# EasyEDA Pro project ProProject_gps打窝船_2025-04-29.epro, board PCB3
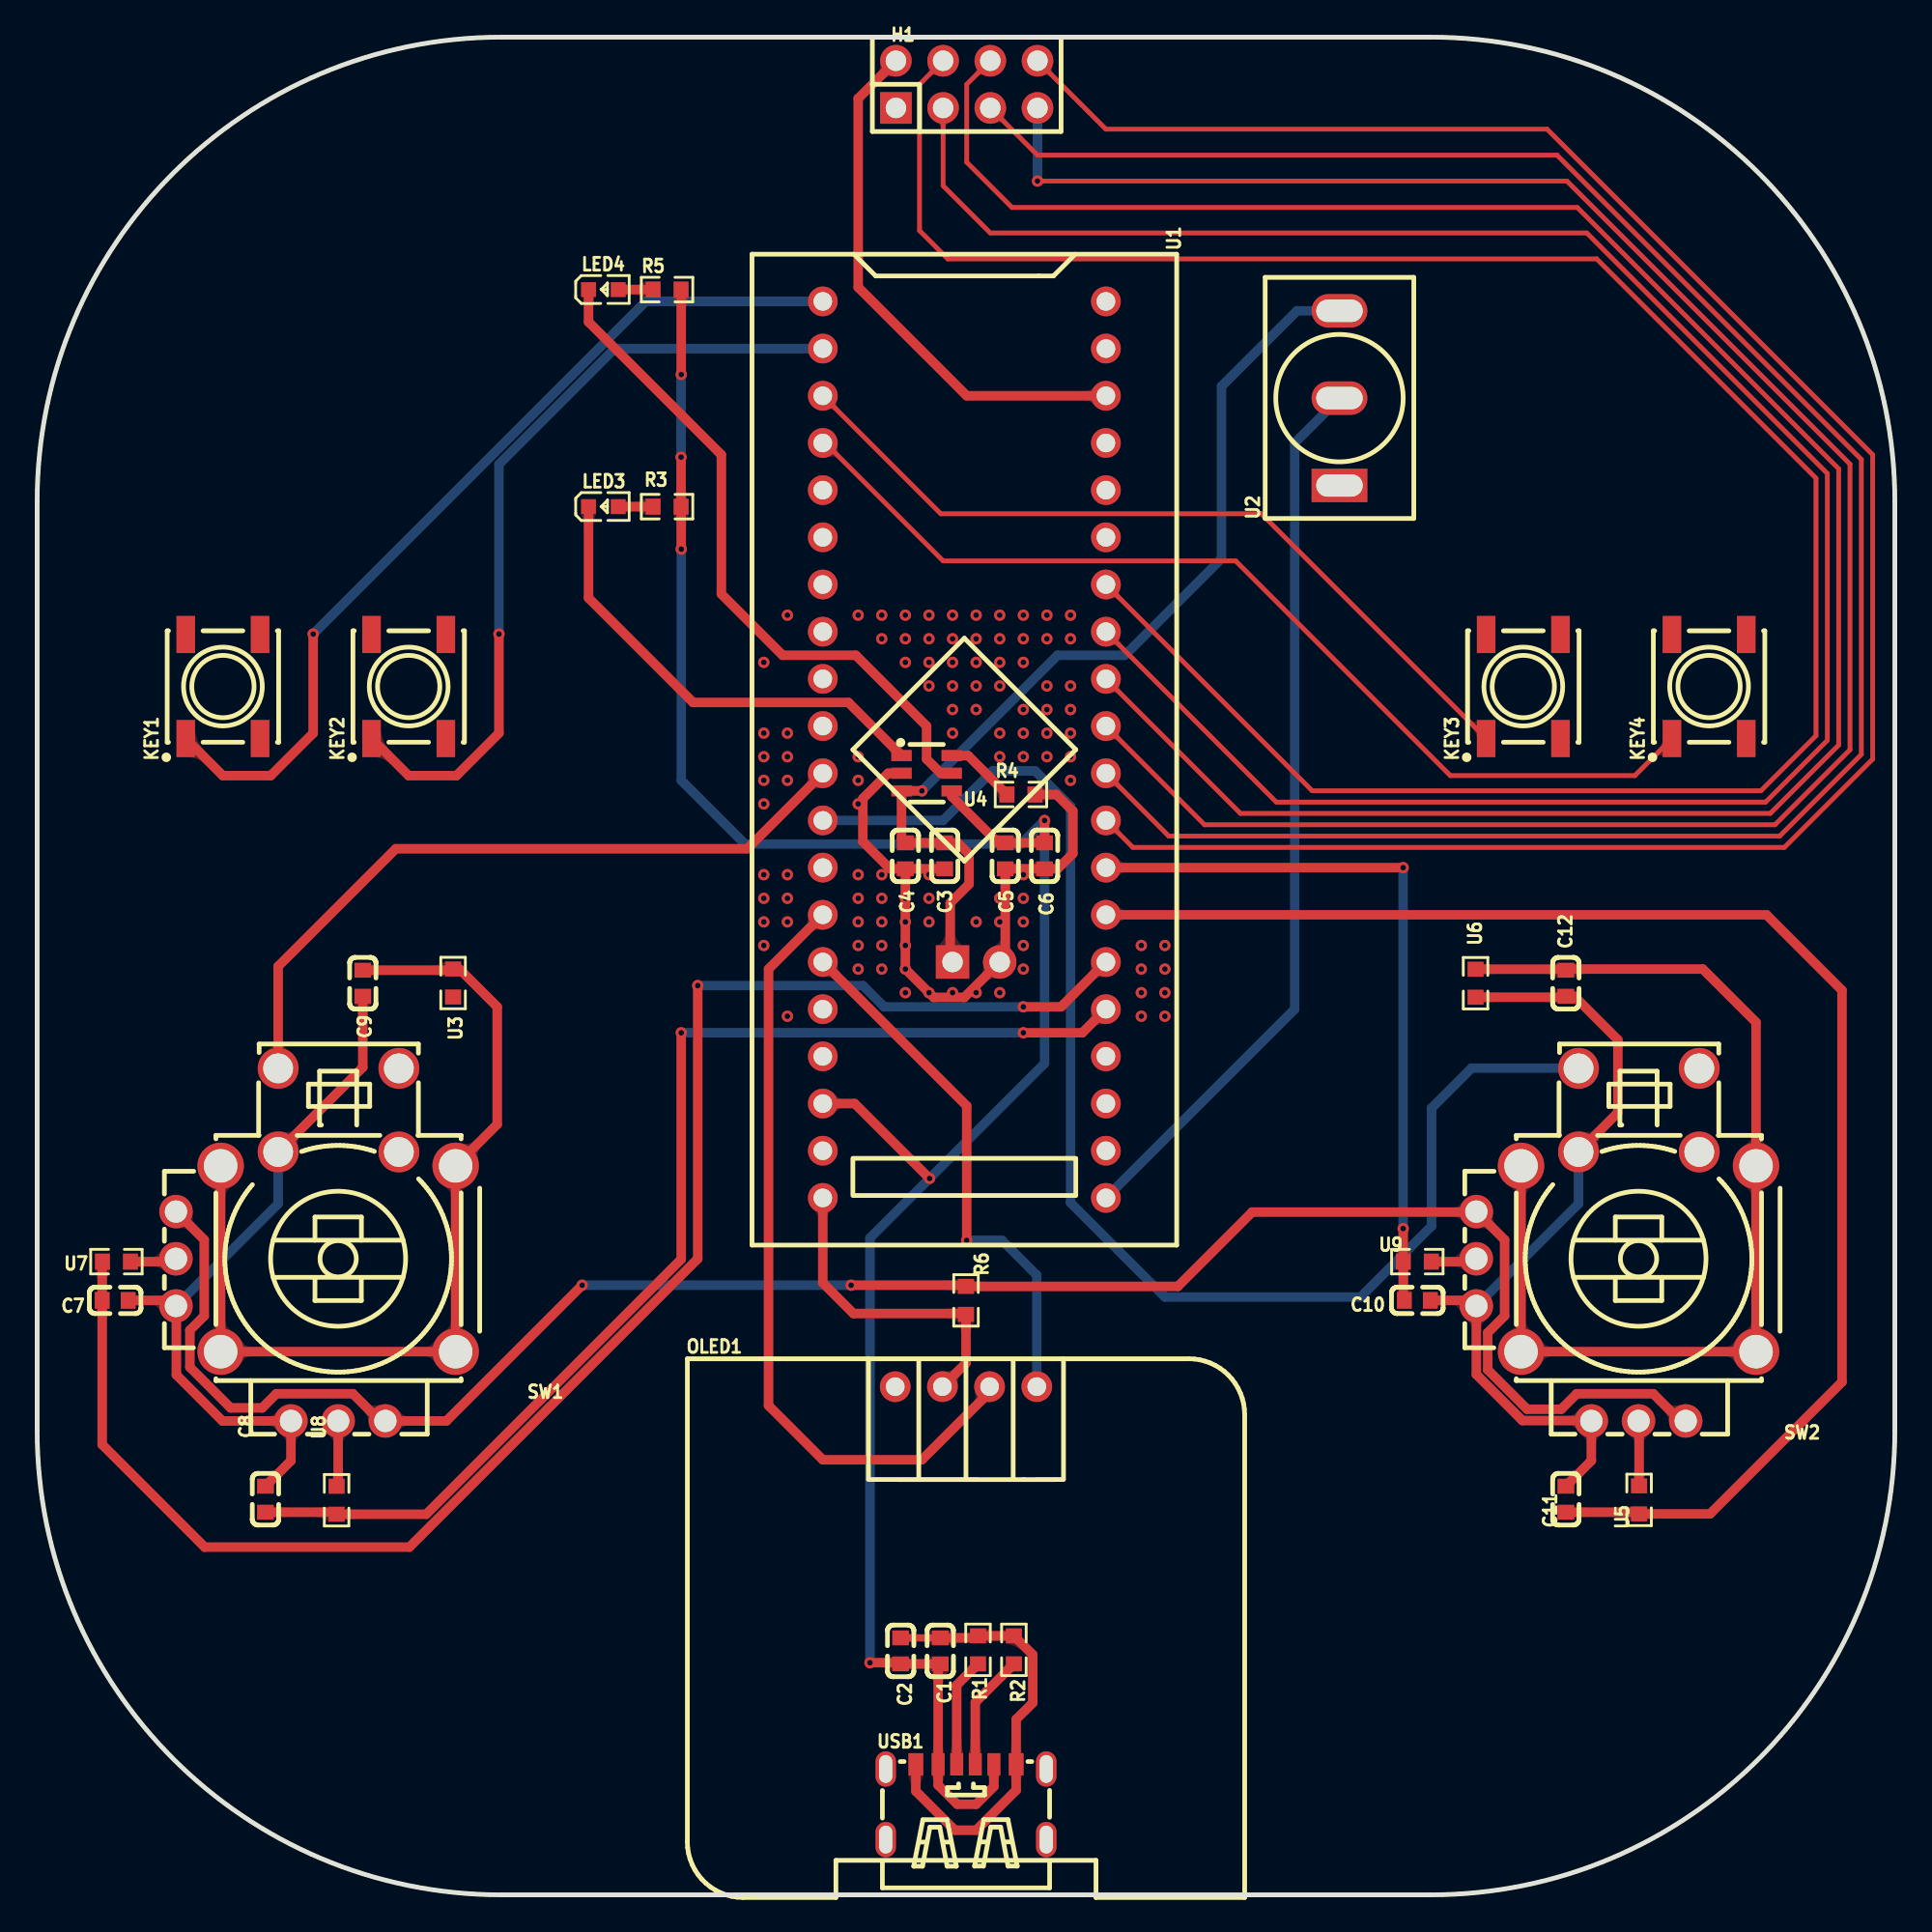
[diagram p2: board, top side]
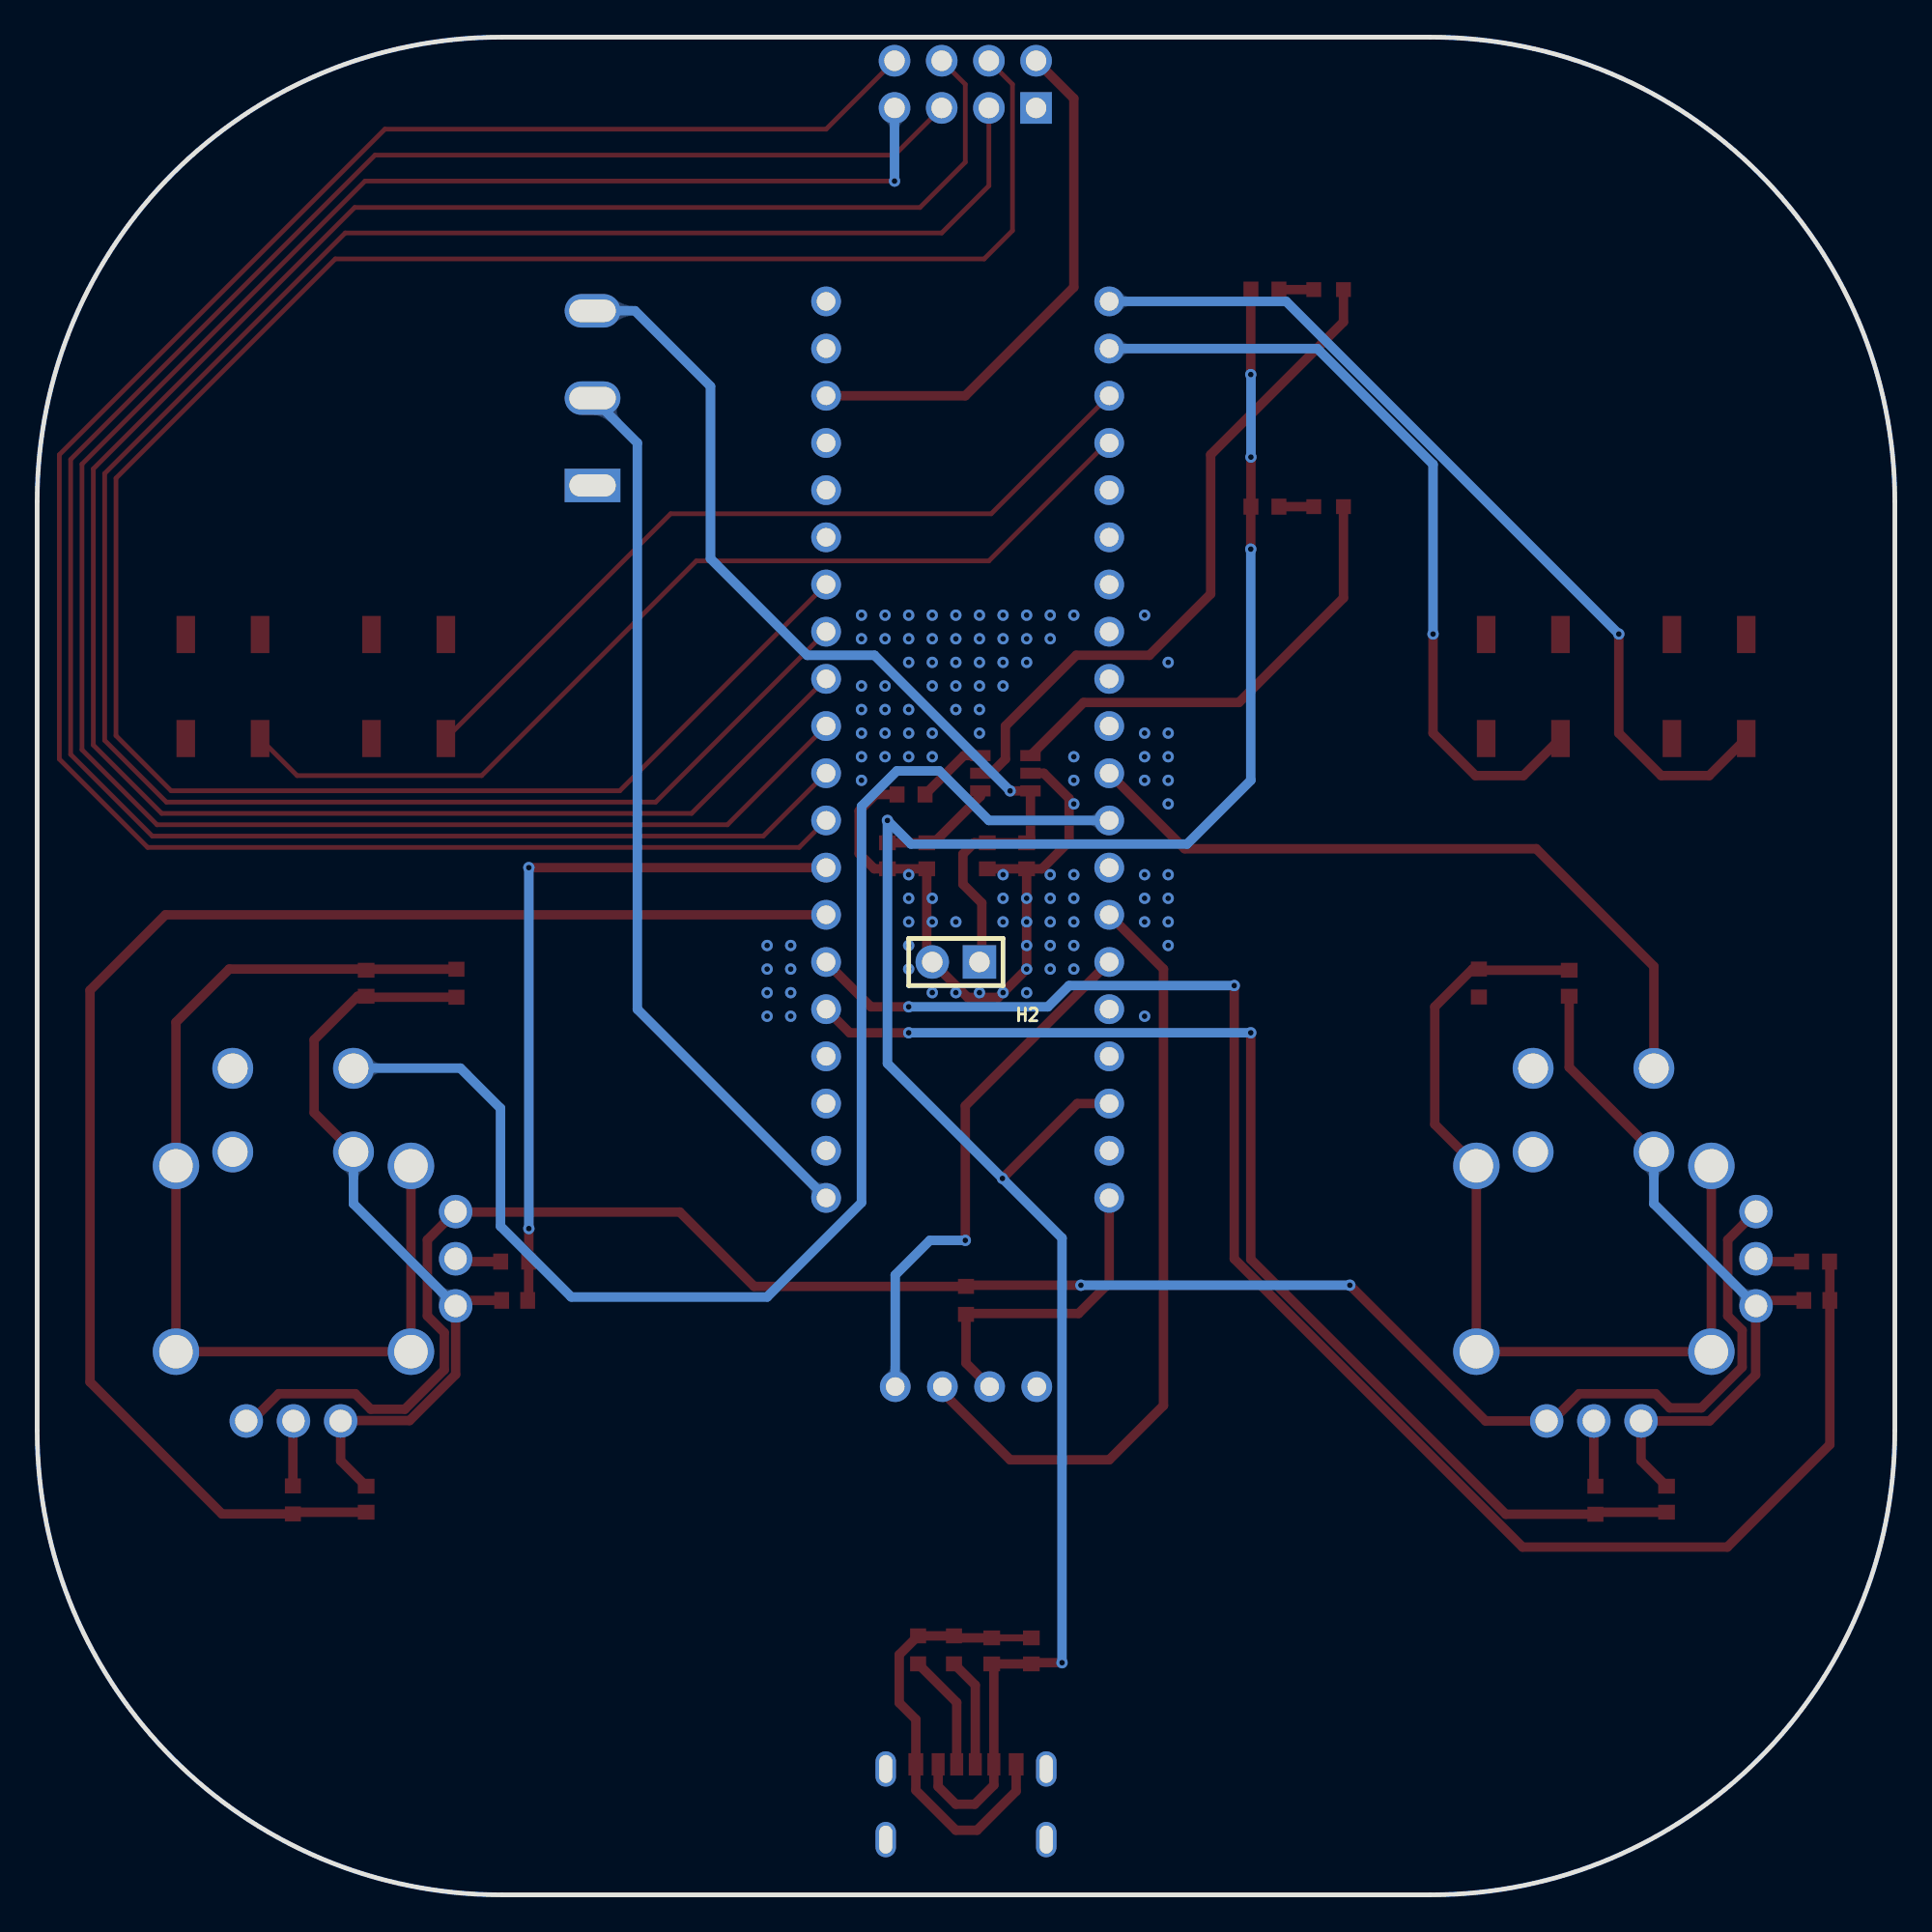
[diagram p3: board, bottom side, seen from below]

Outline 100 x 100 mm; copper layers: Top Layer, Bottom Layer. Coordinates in mm from the lower left corner of the outline.
Outline path: 0,75 arc(7.32,92.68) 25,100 75,100 arc(92.68,92.68) 100,75 100,25 arc(92.68,7.32) 75,0 25,0 arc(7.32,7.32) 0,25 0,75
Stack: Top Layer 0.035mm / Dielectric1 1.51mm FR4 er 4.5 / Bottom Layer 0.035mm

## Design rules (mm)
template: 自定义配置
spacing copperThickness1oz (default): track to track 0.102, other pairs 0.152 to 0.3
spacing copperThickness2oz: track to track 0.203, other pairs 0.152 to 0.3
track width copperThickness1oz (default): min 0.127, default 0.254, max 2.54
track width copperThickness2oz: min 0.203, default 0.254, max 2.54
differential pair differentialPair (default): width min 0.127, default 0.254, max 2.54; gap min 0.152, default 0.152
via viaSize (default): diameter min 0.5, default 0.61, max 10; hole min 0.3, default 0.305, max 6.3

## Placement (name value [footprint] x y rotation side)
C1  22uF  [C0603]  48.61 13.13 270 top
C2  100nf  [C0603]  46.48 13.13 270 top
C3  1uF  [C0603]  48.85 55.93 90 top
C4  10uF  [C0603]  46.74 55.93 90 top
C5  1uF  [C0603]  52.11 55.93 90 top
C6  10uF  [C0603]  54.23 55.93 90 top
C7  1nF  [C0603]  4.2 32 0 top
C8  1nF  [C0603]  12.29 21.3 270 top
C9  100nF  [C0603]  17.53 49.07 90 top
C10  1nF  [C0603]  74.29 32 0 top
C11  1nF  [C0603]  82.29 21.3 270 top
C12  100nF  [C0603]  82.29 49.07 90 top
H1  PZ254V-12-8P  [HDR-TH_8P-P2.54-V-M-R2-C4-S2.54]  50.04 97.46 0 top
H2  PH2.54-01-02PZD  [HDR-TH_2P-P2.54-V-M-1]  50.55 50.22 0 bottom
KEY1  KEY_6.5X6.5X5-4P  [KEY-SMD_4P-L6.0-W6.0-P4.00-LS6.7]  10 65.04 90 top
KEY2  KEY_6.5X6.5X5-4P  [KEY-SMD_4P-L6.0-W6.0-P4.00-LS6.7]  20 65.04 90 top
KEY3  KEY_6.5X6.5X5-4P  [KEY-SMD_4P-L6.0-W6.0-P4.00-LS6.7]  80 65.04 90 top
KEY4  KEY_6.5X6.5X5-4P  [KEY-SMD_4P-L6.0-W6.0-P4.00-LS6.7]  90 65.04 90 top
LED3  LTST-C190YKT  [LED0603-RD]  30.48 74.73 0 top
LED4  LTST-C190YKT  [LED0603-RD]  30.48 86.41 0 top
OLED1  -  [0.96OLED_4P]  50 27.36 0 top
R1  5.1kΩ  [R0603]  50.65 13.19 90 top
R2  5.1kΩ  [R0603]  52.58 13.19 90 top
R3  1kΩ  [R0603]  33.91 74.73 180 top
R4  2kΩ  [R0603]  52.96 59.23 0 top
R5  1kΩ  [R0603]  33.91 86.41 0 top
R6  0Ω  [R0603]  50 32 270 top
SW1  THB001P  [SW-TH_THB001P]  15 35 180 top
SW2  THB001P  [SW-TH_THB001P]  85 35 180 top
U1  STM32F103C8T6-Card  [CONN-TH_L53.3-W22.9_STM32F103C8T6-CARD]  49.91 61.65 270 top
U2  MT-0-102-A101-M200-RS  [SW-TH_MT-0-103-A101-M200-RS]  70.1 80.57 90 top
U3  1M  [R0603]  22.39 49.08 90 top
U4  TP4057  [SOT-23-6_L2.9-W1.6-P0.95-LS2.8-BR]  47.88 60.38 180 top
U5  1K  [R0603]  86.23 21.26 270 top
U6  1M  [R0603]  77.43 49.07 90 top
U7  1K  [R0603]  4.27 34.09 180 top
U8  1K  [R0603]  16.12 21.24 270 top
U9  1K  [R0603]  74.29 34.09 180 top
USB1  TYPE-C 6P  [TYPE-C-SMD_TYPE-C-6P]  50 5 0 top

## Footprints (pads in the part's own frame, mm; a bottom-side part is the same pattern mirrored in y, then rotated)
0.96OLED_4P
  round 1.65 hole 1: 1(-3.81,-0.002) 2(-1.27,0.002) 3(1.27,0.002) 4(3.81,0.002)
C0603
  rect 0.8x0.9 smd: 1(-0.7,0) 2(0.7,0)
CONN-TH_L53.3-W22.9_STM32F103C8T6-CARD
  round 1.6 hole 1: 1(-24.13,-7.62) 2(-21.59,-7.62) 3(-19.05,-7.62) 4(-16.51,-7.62) 5(-13.97,-7.62) 6(-11.43,-7.62) 7(-8.89,-7.62) 8(-6.35,-7.62) 9(-3.81,-7.62) 10(-1.27,-7.62) 11(1.27,-7.62) 12(3.81,-7.62) 13(6.35,-7.62) 14(8.89,-7.62) 15(11.43,-7.62) 16(13.97,-7.62) 17(16.51,-7.62) 18(19.05,-7.62) 19(21.59,-7.62) 20(24.13,-7.62) 21(24.13,7.62) 22(21.59,7.62) 23(19.05,7.62) 24(16.51,7.62) 25(13.97,7.62) 26(11.43,7.62) 27(8.89,7.62) 28(6.35,7.62) 29(3.81,7.62) 30(1.27,7.62) 31(-1.27,7.62) 32(-3.81,7.62) 33(-6.35,7.62) 34(-8.89,7.62) 35(-11.43,7.62) 36(-13.97,7.62) 37(-16.51,7.62) 38(-19.05,7.62) 39(-21.59,7.62) 40(-24.13,7.62)
HDR-TH_2P-P2.54-V-M-1
  rect 1.8x1.8 hole 1.1: 1(-1.27,0)
  round 1.8 hole 1.1: 2(1.27,0)
HDR-TH_8P-P2.54-V-M-R2-C4-S2.54
  rect 1.7x1.7 hole 1.1: 1(-3.81,-1.27)
  round 1.7 hole 1.1: 2(-3.81,1.27) 3(-1.27,-1.27) 4(-1.27,1.27) 5(1.27,-1.27) 6(1.27,1.27) 7(3.81,-1.27) 8(3.81,1.27)
KEY-SMD_4P-L6.0-W6.0-P4.00-LS6.7
  rect 2x1 smd: 1(-2.8,2) 2(2.8,2) 3(-2.8,-2) 4(2.8,-2)
LED0603-RD
  rect 0.8x0.8 smd: 1(-0.799,0) 2(0.799,0)
R0603
  rect 0.806x0.864 smd: 1(-0.753,0) 2(0.753,0)
SOT-23-6_L2.9-W1.6-P0.95-LS2.8-BR
  rect 1.1x0.6 smd: 1(1.35,-0.95) 2(1.35,0) 3(1.35,0.95) 4(-1.35,0.95) 5(-1.35,0) 6(-1.35,-0.95)
SW-TH_MT-0-103-A101-M200-RS
  rect 1.8x3 hole 1.2x2.5: 1(-4.7,0)
  oval 1.8x3 hole 1.2x2.5: 2(0,0) 3(4.7,0)
SW-TH_THB001P
  round 1.8 hole 1.2: 1(7.527,-1.78) 2(7.527,0.76) 3(7.527,3.3) 4(1.337,9.49) 5(-1.202,9.49) 6(-3.743,9.49)
  round 2.5 hole 1.8: 7(-7.527,5.76) 8(-7.527,-4.24) 9(5.122,-4.24) 10(5.122,5.76)
  round 2.2 hole 1.6: a(-4.472,-4.99) b(2.028,-4.99) c(-4.472,-9.49) d(2.028,-9.49)
TYPE-C-SMD_TYPE-C-6P
  oval 1.1x1.9 hole 0.7x1.5: 7(-4.32,1.775) 7(-4.32,-2.025) 7(4.32,1.775) 7(4.32,-2.025)
  rect 0.7x1.2 smd: A5(-0.5,2.025) A9(1.5,2.025) B5(0.5,2.025) B9(-1.5,2.025)
  rect 0.8x1.2 smd: A12(2.7,2.025) B12(-2.7,2.025)

## Nets
As in the schematic, except:
GND: C1.1 C2.1 C3.1 C4.1 C5.1 C6.1 C7.2 C8.1 C9.1 C10.2 C11.1 C12.1 H1.1 H2.2 KEY1.4 KEY2.4 KEY3.4 KEY4.4 OLED1.1 R1.2 R2.2 R4.2 SW1.3 SW1.4 SW1.b SW2.3 SW2.4 SW2.b U1.19 U1.39 U1.40 U3.1 U4.2 U6.1 USB1.A12 USB1.B12
VCC3V3: H1.2 OLED1.2 R6.2 U1.20 U1.38
$1N2627: OLED1.4 U1.15
$1N2638: OLED1.3 U1.14

Pads without a net: KEY1 2 3; KEY2 2 3; KEY3 2 3; KEY4 2 3; SW1 a c; SW2 a c; U1 5 6 7 8 9 10 13 16 17 22 23 24 35 36 37; U2 1; USB1 7

## Via types
v1: diameter 0.61, hole 0.305, Top Layer to Bottom Layer, 123 vias

## Routing (per net, layer and track width the routed paths; a pad name or vN(x,y) marks a point on that pad's centre or on a via; arc(x,y) is an arc through that point)
+5V: length 127.5
  Top Layer w0.508: v1(54.23,57.84) C6.2 51.73,56.63 49.23,59.13 U4.4 ; v1(34.66,77.39) R3.1 34.67,74.72 v1(34.67,72.44) ; v1(48.04,38.56) 44.01,42.6 U1.18 ; v1(44.83,12.5) 46.42,12.5 C2.2 C1.2 48.5,12.32 USB1.B9 48.5,5.91 49.53,4.88 50.55,4.88 51.5,5.83 USB1.A9 ; v1(34.67,81.84) 34.67,86.4 R5.2
  Bottom Layer w0.508: v1(34.67,81.84) 34.66,81.83 v1(34.66,77.39) ; v1(44.83,12.5) 44.83,35.36 v1(48.04,38.56) 54.23,44.75 v1(54.23,57.84) 52.96,56.57 38.1,56.57 34.67,60 v1(34.67,72.44)
GND: length 141.8
  Top Layer w0.381: C2.1 C1.1
  Top Layer w0.508: U6.1 82.24,48.32 C12.1 82.74,48.37 85.09,46.03 85.09,42.11 SW2.b ; SW1.b 17.53,44.55 C9.1 ; R4.2 54.86,59.23 55.75,58.34 55.75,56.05 54.93,55.23 C6.1 C5.1 52.11,50.51 H2.2 49.91,48.31 48.26,48.31 v1(48.01,48.56) v1(46.74,49.83) v1(46.74,51.11) v1(46.74,52.38) v1(46.74,53.64) C4.1 ; C4.1 45.91,55.23 44.45,56.69 44.45,59.02 45.81,60.38 U4.2 ; C4.1 C3.1 ; 75,32 77.17,32 SW2.3 77.47,28.01 79.95,25.53 83.64,25.53 ; USB1.B12 47.3,5.58 49.4,3.48 50.55,3.48 52.7,5.63 USB1.A12 52.7,9.44 53.59,10.34 53.59,12.93 R2.2 R1.2 50.54,13.83 C1.1 ; C7.2 7.17,32 SW1.3 7.49,31.68 7.49,27.99 9.97,25.51 SW1.4 13.66,23.37 C8.1 ; C11.1 83.66,23.37 SW2.4
  Bottom Layer w0.508: SW1.3 12.97,37.2 SW1.b ; SW2.b 82.97,37.2 SW2.3
  vias: v1(39.12,66.34) v1(39.12,62.53) v1(39.12,61.27) v1(39.12,60) v1(39.12,58.72) v1(39.12,54.92) v1(39.12,53.64) v1(39.12,52.38) v1(39.12,51.11) v1(40.39,68.89) v1(40.39,62.53) v1(40.39,61.27) v1(40.39,60) v1(40.39,54.92) v1(40.39,53.64) v1(40.39,52.38) v1(40.39,47.3) v1(44.2,68.89) v1(44.2,61.27) v1(44.2,60) v1(44.2,58.72) v1(44.2,54.92) v1(44.2,53.64) v1(44.2,52.38) v1(44.2,51.11) v1(44.2,49.83) v1(45.47,68.89) v1(45.47,67.61) v1(45.47,54.92) v1(45.47,53.64) v1(45.47,52.38) v1(45.47,51.11) v1(45.47,49.83) v1(46.74,68.89) v1(46.74,67.61) v1(46.74,66.34) v1(46.74,48.56) v1(48.01,68.89) v1(48.01,67.61) v1(48.01,66.34) v1(48.01,65.08) v1(48.01,54.92) v1(48.01,53.64) v1(48.01,52.38) v1(49.28,68.89) v1(49.28,67.61) v1(49.28,66.34) v1(49.28,65.08) v1(49.28,63.81) v1(49.28,62.53) v1(49.28,48.56) v1(50.55,68.89) v1(50.55,67.61) v1(50.55,66.34) v1(50.55,65.08) v1(50.55,63.81) v1(50.55,52.38) v1(50.55,48.56) v1(51.82,68.89) v1(51.82,67.61) v1(51.82,66.34) v1(51.82,65.08) v1(51.82,62.53) v1(51.82,61.27) v1(51.82,53.64) v1(51.82,52.38) v1(51.82,48.56) v1(53.09,68.89) v1(53.09,67.61) v1(53.09,66.34) v1(53.09,63.81) v1(53.09,62.53) v1(53.09,61.27) v1(53.09,54.92) v1(53.09,53.64) v1(53.09,52.38) v1(53.09,51.11) v1(53.09,49.83) v1(54.36,68.89) v1(54.36,67.61) v1(54.36,65.08) v1(54.36,63.81) v1(54.36,62.53) v1(54.36,61.27) v1(55.63,68.89) v1(55.63,67.61) v1(55.63,65.08) v1(55.63,63.81) v1(55.63,62.53) v1(55.63,61.27) v1(55.63,60) v1(59.44,51.11) v1(59.44,49.83) v1(59.44,48.56) v1(59.44,47.3) v1(60.71,51.11) v1(60.71,49.83) v1(60.71,48.56) v1(60.71,47.3)
VCC3V3: length 46.2
  Top Layer w0.508: OLED1.2 50,28.63 R6.2 49.95,31.29 43.94,31.29 42.29,32.94 U1.20 ; U1.38 50.04,80.7 44.2,86.54 44.2,96.7 H1.2
32BAT: length 48.3
  Bottom Layer w0.508: U1.21 67.69,47.68 67.69,78.16 U2.2
BAT: length 52.5
  Top Layer w0.508: 49.15,50.22 49.15,53.39 50.16,54.41 50.16,56.02 49.56,56.63 C3.2 C4.2 46.53,56.84 U4.3 v1(47.62,59.43)
  Bottom Layer w0.508: U2.3 67.82,85.27 63.75,81.2 63.75,71.93 58.55,66.73 54.93,66.73 v1(47.62,59.43)
PA0: length 63.7
  Top Layer w0.508: v1(53.09,46.41) 56.26,46.41 U1.25 ; C8.2 16.01,20.6 U8.2 20.95,20.49 34.67,34.21 v1(34.67,46.41)
  Bottom Layer w0.508: v1(34.67,46.41) v1(53.09,46.41)
PA1: length 88.8
  Top Layer w0.508: v1(53.09,47.8) 55.12,47.8 U1.26 ; U7.2 3.5,34.07 C7.1 3.5,24.24 9.02,18.72 20.04,18.72 35.56,34.24 v1(35.56,48.95)
  Bottom Layer w0.508: v1(53.09,47.8) 45.59,47.8 44.45,48.95 v1(35.56,48.95)
PA2: length 80.2
  Top Layer w0.508: U1.27 93.09,52.76 97.16,48.69 97.16,27.61 90.05,20.51 U5.2 86.14,20.6 C11.2
PA3: length 39.3
  Top Layer w0.508: C10.1 73.54,32.05 U9.2 73.53,34.1 v1(73.53,35.86) ; U1.28 v1(73.53,55.3)
  Bottom Layer w0.508: v1(73.53,35.86) v1(73.53,55.3)
PA4: length 114
  Top Layer w0.254: H1.8 57.53,95.05 81.28,95.05 98.81,77.52 98.81,61.14 94.05,56.38 58.98,56.38 U1.29
PA5: length 114.5
  Top Layer w0.254: U1.30 60.91,56.99 93.8,56.99 98.2,61.39 98.2,77.27 81.81,93.65 53.85,93.65 H1.5
PA6: length 113.3
  Top Layer w0.254: U1.31 62.84,57.6 93.55,57.6 97.59,61.64 97.59,77.02 82.35,92.25 v1(53.85,92.25)
  Bottom Layer w0.508: v1(53.85,92.25) H1.7
PA7: length 118.6
  Top Layer w0.254: H1.6 50.04,97.46 50.04,93.27 52.47,90.83 82.91,90.83 96.98,76.76 96.98,61.89 93.29,58.21 64.77,58.21 U1.32
PB0: length 116.6
  Top Layer w0.254: U1.33 66.7,58.82 93.04,58.82 96.37,62.15 96.37,76.51 83.42,89.46 51.31,89.46 48.77,92 H1.3
PB1: length 121.4
  Top Layer w0.254: U1.34 68.63,59.43 92.79,59.43 95.76,62.4 95.76,76.26 83.95,88.06 49.02,88.06 47.5,89.59 47.5,97.46 H1.4
PB3: length 39.1
  Top Layer w0.508: SW1.d 12.97,49.98 19.3,56.31 38.23,56.31 U1.11
PB4: length 74.8
  Bottom Layer w0.508: SW2.d 82.96,44.5 77.22,44.5 75.06,42.34 75.06,35.99 71.25,32.18 60.71,32.18 55.63,37.26 55.63,58.6 53.72,60.5 51.44,60.5 48.77,57.84 U1.12
PB12: length 48.8
  Top Layer w0.508: KEY1.1 10,60.25 12.57,60.25 14.86,62.53 v1(14.86,67.87)
  Bottom Layer w0.508: v1(14.86,67.87) 32.77,85.78 U1.1
PB13: length 43.1
  Top Layer w0.508: KEY2.1 20,60.25 22.57,60.25 24.86,62.53 v1(24.86,67.87)
  Bottom Layer w0.508: U1.2 31.09,83.24 24.86,77.01 v1(24.86,67.87)
PB14: length 43.4
  Top Layer w0.254: U1.3 48.64,74.35 65.9,74.35 KEY3.1
PB15: length 54
  Top Layer w0.254: KEY4.1 86,60.25 76.07,60.25 64.52,71.81 48.77,71.81 42.42,78.16 U1.4
VADC: length 107.1
  Top Layer w0.508: v1(43.81,32.82) 49.94,32.82 R6.1 61.4,32.75 65.41,36.75 77.45,36.75 SW2.1 78.99,35.26 78.99,31.17 78.08,30.25 78.08,28.26 80.21,26.14 82.04,26.14 82.88,26.97 87,26.97 88.46,25.51 SW2.6 ; SW1.1 8.99,35.26 8.99,31.17 8.22,30.39 8.22,28.41 10.41,26.21 12.11,26.21 12.88,26.97 17,26.97 18.46,25.51 SW1.6 22.03,25.51 v1(29.34,32.82)
  Bottom Layer w0.508: v1(43.81,32.82) v1(29.34,32.82)
$1N765: length 5.9
  Top Layer w0.508: R1.1 49.5,11.29 USB1.A5
$1N804: length 6.3
  Top Layer w0.508: R2.1 50.5,10.36 USB1.B5
$1N2627: length 28.7
  Top Layer w0.508: U1.15 50.04,42.47 v1(50.04,35.23)
  Bottom Layer w0.508: v1(50.04,35.23) 51.94,35.23 53.81,33.36 OLED1.4
$1N2638: length 42.5
  Top Layer w0.508: U1.14 39.37,49.83 39.37,26.34 42.29,23.42 47.62,23.42 51.27,27.06 OLED1.3
$1N3595: length 25.3
  Top Layer w0.508: 29.68,74.79 29.68,69.81 35.31,64.19 43.67,64.19 U4.1
$1N3637: length 1.9
  Top Layer w0.508: LED3.2 R3.2
$1N3713: length 3.8
  Top Layer w0.508: U4.6 50.11,61.33 R4.1
$1N3983: length 36.7
  Top Layer w0.508: 29.68,86.36 29.68,84.67 36.83,77.52 36.83,70.03 40.13,66.73 44.07,66.73 47.88,62.92 47.88,61.14 48.64,60.38 U4.5
$1N4198: length 1.9
  Top Layer w0.508: LED4.2 R5.1
$1N5842: length 2.5
  Top Layer w0.508: SW1.2 7.32,34.09 U7.1
$1N5916: length 3.5
  Top Layer w0.508: U8.1 16.2,22.08 SW1.5
$1N7403: length 50.2
  Top Layer w0.508: C9.2 22.33,49.77 U3.2 22.73,49.84 24.77,47.8 24.77,41.48 SW1.8 SW1.7 SW1.10 SW1.9
$1N7897: length 2.5
  Top Layer w0.508: SW2.2 77.32,34.09 U9.1
$1N7914: length 3.5
  Top Layer w0.508: U5.1 86.23,25.48 SW2.5
$1N7915: length 56.7
  Top Layer w0.508: U6.2 82.24,49.83 C12.2 82.35,49.83 89.66,49.83 92.53,46.97 SW2.8 SW2.7 SW2.10 SW2.9

## Copper pours and planes (outline as drawn; the poured copper is in the pictures)
GND on Top Layer: 39.12,69.65 60.71,69.65 60.71,47.3 39.12,47.3
GND on Top Layer: -5.59,104.95 104.78,104.95 104.78,-5.03 -5.59,-5.03
GND on Bottom Layer: -11.56,108.89 112.14,108.89 112.14,-8.46 -11.56,-8.46

Small or netless copper shapes (teardrops, artwork), in the pictures only: 152 on Top Layer, 14 on Bottom Layer
